# EAGLE schematic NRF24L01_Module_AnTenna_SMD_0603 (EAGLE 9.6.2)
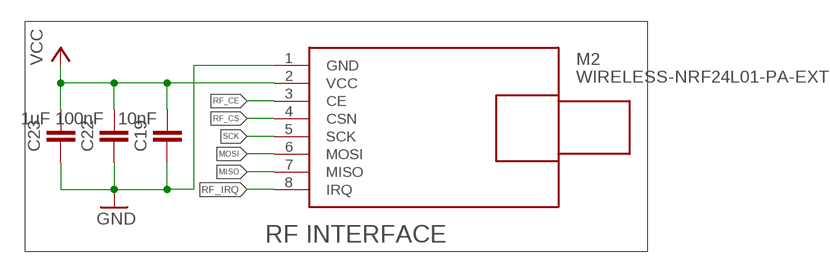
[diagram p0: schematic, sheet 1]

## Parts
C19  10nF  C-EUC0603  [C0603]
C22  100nF  C-EUC0603  [C0603]
C23  1uF  C-EUC0603  [C0603]
M2  WIRELESS-NRF24L01-PA-EXT  [WIRELESS-NRF24L01-PA-EXT]

## Nets
GND: C19.1 C22.1 C23.1 M2.1(GND)
MISO: M2.7(MISO)
MOSI: M2.6(MOSI)
RF_CE: M2.3(CE)
RF_CS: M2.4(CSN)
RF_IRQ: M2.8(IRQ)
SCK: M2.5(SCK)
VCC: C19.2 C22.2 C23.2 M2.2(VCC)

## Notes on the sheet
- RF INTERFACE

## Library data of the parts
C19 C22 C23 = rcl:C-EU: CAPACITOR, European symbol
M2 = diy-modules:WIRELESS-NRF24L01-PA-EXT: 2.4 GHz Wireless Module based on NRF24L01 chip with preamplifier and external antenna Click here to find device on ebay.com <http://www.ebay.com/sch/nrf24l01+pa+lna+sma>